# Altium schematic sheet VoiceCoil.SchDoc: <title>
size A4; Organization: Institut d'Automatisation Industrielle; SheetNumber: 1; SheetTotal: 2; SVN: OUI; CurrentTime: 6; CurrentDate: 5; DocumentFullPathAndName: 8; DocumentName: 9; ModifiedDate: 13; ProjectName: <projet>
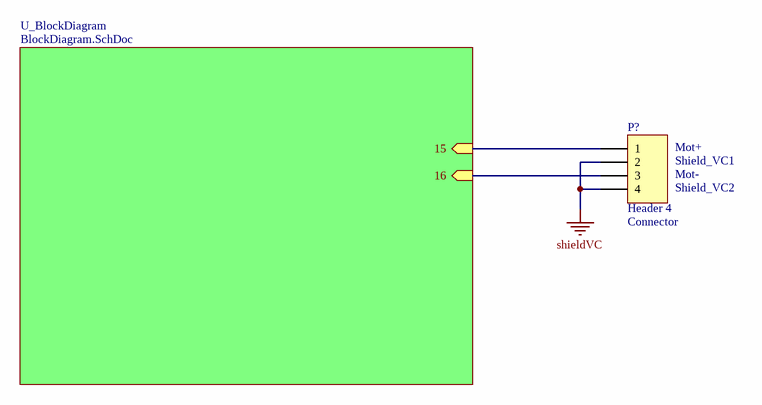
[diagram p0: VoiceCoil.SchDoc]

## Parts
P?  Header 4  System: Connector  [HDR1X4]

## Sub-sheets
U_BlockDiagram = BlockDiagram.SchDoc: 15 (in), 16 (in)

## Nets
shieldVC: P?.2 P?.4
NetP?_1: P?.1 ; sheet U_BlockDiagram/15
NetP?_3: P?.3 ; sheet U_BlockDiagram/16

## Notes on the sheet
- (near P?) Mot+
- (near P?) Shield_VC1
- (near P?) Mot-
- (near P?) Shield_VC2
- Title
- Institut d'automatisation industrielle
  rte de Cheseaux 1
  CH-1401 Yverdon-les-Bains
  T +41(0)24 55 77 377    F +41(0)24 55 76 320
  http://iai.heig-vd.ch       iai@heig-vd.ch
- Date:
- Size:
- A4
- Project:
- Sheet
- of
- No.
- Author:
- SVN
- Version
- File:

## Library data of the parts
P? = Header 4: Header, 4-Pin; LatestRevisionDate: 17-Jul-2002; LatestRevisionNote: Re-released for DXP Platform.; Publisher: Altium Limited